# EasyEDA Pro project 赛博樱花灯.epro, schematic Schematic2
Board Name: 下主板V0.1; Create Date: 2025-05-02; Page Name: P1; Project Name: 噬菌体拾音灯; Schematic Name: Schematic2; Update Date: 2025-05-07; Company: 嘉立创EDA; Page Size: A3; Version: V1.0
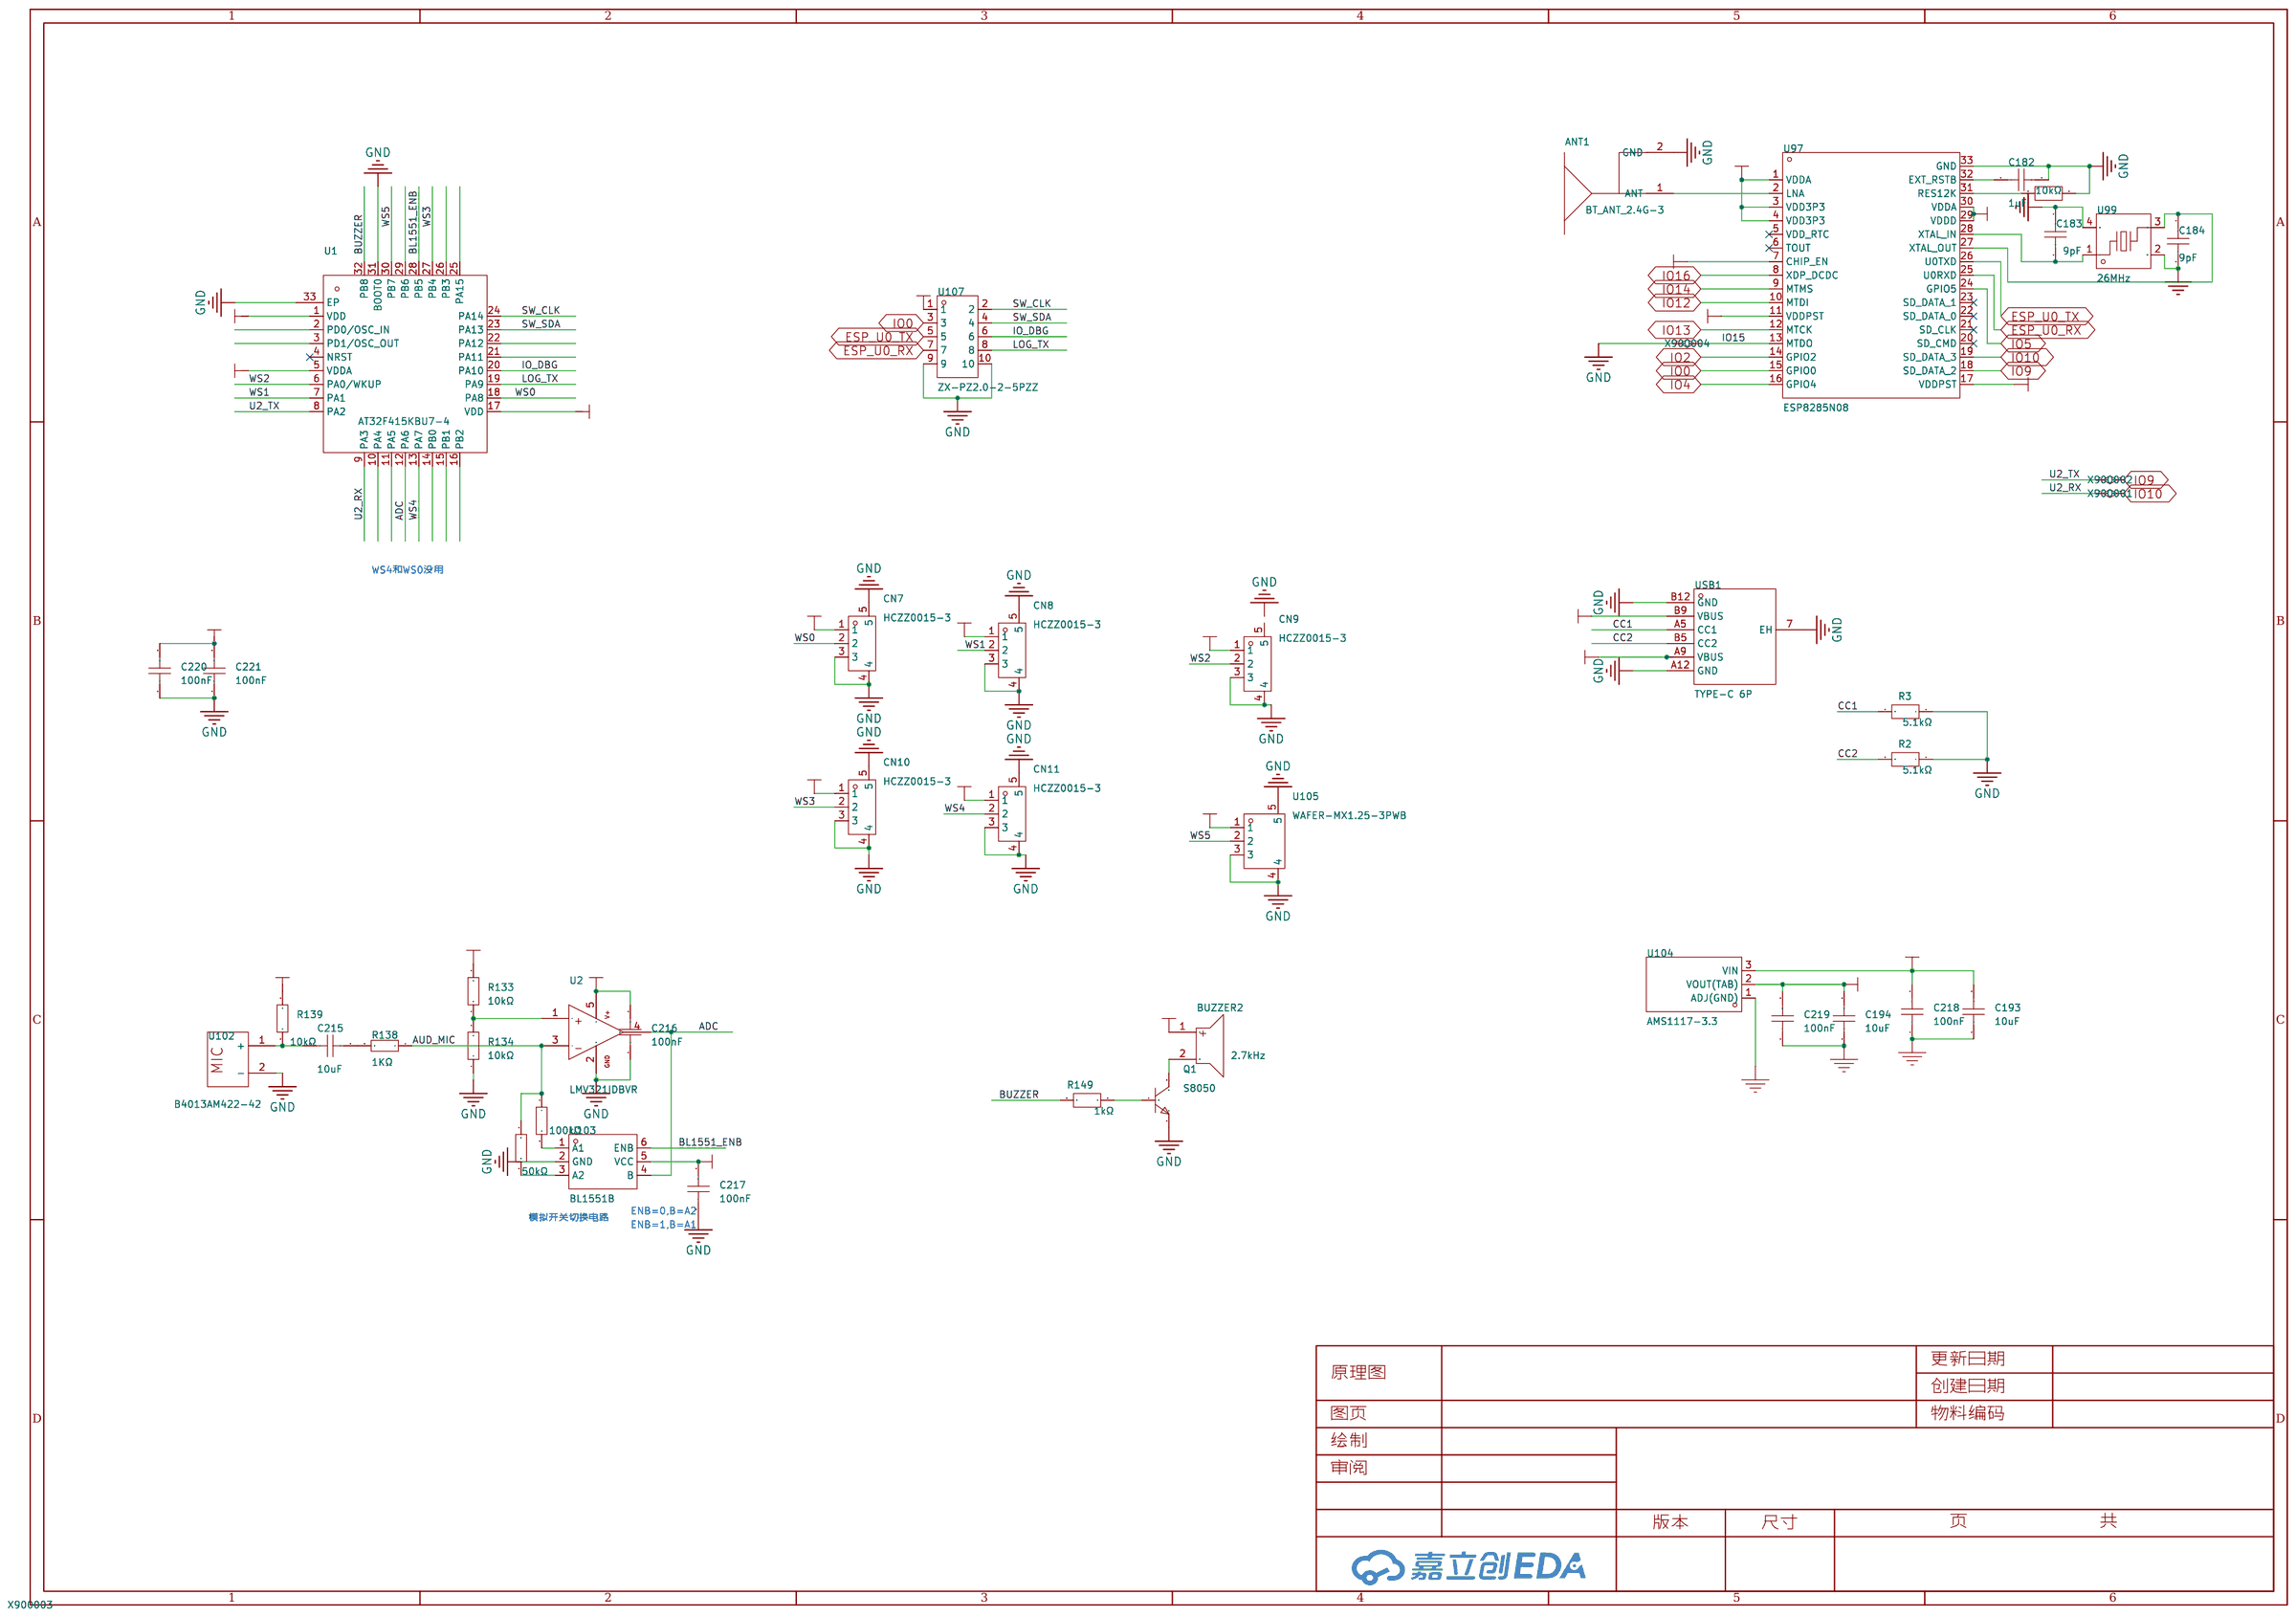
[diagram p2: schematic sheet]

## Parts
ANT1  BT_ANT_2.4G-3  [ANT-2.4G-3]
BUZZER2  2.7kHz  [BUZ-TH_BD9.0-P4.00-D0.6-FD]
C182  1uF  [C0603]
C183  9pF  [C0603]
C184  9pF  [C0603]
C193  10uF  [C0603]
C194  10uF  [C0603]
C215  10uF  [C0402]
C216  100nF  [C0603]
C217  100nF  [C0603]
C218  100nF  [C0603]
C219  100nF  [C0603]
C220  100nF  [C0603]
C221  100nF  [C0603]
CN7  HCZZ0015-3  [CONN-SMD_3P-P1.25-L3.3-W8.8]
CN8  HCZZ0015-3  [CONN-SMD_3P-P1.25-L3.3-W8.8]
CN9  HCZZ0015-3  [CONN-SMD_3P-P1.25-L3.3-W8.8]
CN10  HCZZ0015-3  [CONN-SMD_3P-P1.25-L3.3-W8.8]
CN11  HCZZ0015-3  [CONN-SMD_3P-P1.25-L3.3-W8.8]
Q1  S8050  [SOT-23-3_L2.9-W1.3-P1.90-LS2.3-BR]
R2  5.1kΩ  [R0603]
R3  5.1kΩ  [R0603]
R133  10kΩ  [R0402]
R134  10kΩ  [R0402]
R138  1KΩ  [R0402]
R139  10kΩ  [R0402]
R146  10kΩ  [R0603]
R147  100kΩ  [R0402]
R148  50kΩ  [R0402]
R149  1kΩ  [R0603]
U1  AT32F415KBU7-4  [QFN-32_L4.0-W4.0-P0.40-BL-EP2.7]
U2  LMV321IDBVR  [SOT-23-5_L3.0-W1.7-P0.95-LS2.8-BR]
U97  ESP8285N08  [QFN-32_L5.0-W5.0-P0.50-TL-EP3.7]
U99  26MHz  [CRYSTAL-SMD_4P-L3.2-W2.5-BL]
U102  B4013AM422-42  [MIC-SMD_3P-BD4.0-P1.35_B4013AM423-093]
U103  BL1551B  [SC-70-6_L2.1-W1.3-P0.65-LS2.3-BR]
U104  AMS1117-3.3  [SOT-89_L4.5-W2.5-P1.50-LS4.2-BR]
U105  WAFER-MX1.25-3PWB  [CONN-SMD_3P-P1.25_WAFER-MX1.25-3PWB]
U107  ZX-PZ2.0-2-5PZZ  [HDR-TH_10P-P2.00-V-M-R2-C5-S2.00]
USB1  TYPE-C 6P  [TYPE-C-SMD_TYPE-C-6P]

## Library data of the parts
ANT1 = BT_ANT_2.4G-3
BUZZER2 = QMB-09B-03: 驱动方式:无源(外部驱动);构造类型:电磁式;频率:2.7kHz;声压(SPL):85dB;; LCSC Part Name: 无源蜂鸣器QMB-09B-03; Supplier Part: C96256; Manufacturer: 华能; Supplier Footprint: 插件,D=9mm; JLCPCB Part Class: 扩展库; Datasheet: https://atta.szlcsc.com/upload/public/pdf/source/20210401/C96256_958B17753B5AD7CBFBCFFC7C095B4484.pdf; Supplier: LCSC; Driver Circuitry: 无源(外部驱动); Technology: 电磁式; Voltage - Supply: 2V~5V; Sound Pressure Level(SPL): 85dB; Diameter(φD): 9mm; Height: 5.7mm
C182-C184 = CAP_0603: 容值:100nF;精度:±10%;额定电压:50V;温度系数:X7R;; Supplier Footprint: 0603
C193 C194 = CL10A106MA8NRNC: 容值:10uF;精度:±20%;额定电压:25V;材质(温度系数):X5R;; LCSC Part Name: 10uF ±20% 25V; Supplier Part: C96446; Manufacturer: SAMSUNG(三星); Supplier Footprint: 0603; JLCPCB Part Class: 基础库; Datasheet: https://atta.szlcsc.com/upload/public/pdf/source/20160218/1457707763339.pdf; Supplier: LCSC; Tolerance: ±20%; Voltage Rated: 25V; Temperature Coefficient: X5R
C215 = CL05A105KA5NQNC: 容值:1uF;精度:±10%;额定电压:25V;材质(温度系数):X5R;; LCSC Part Name: 1uF ±10% 25V; Supplier Part: C52923; Manufacturer: SAMSUNG(三星); Supplier Footprint: 0402; JLCPCB Part Class: 基础库; Datasheet: https://atta.szlcsc.com/upload/public/pdf/source/20160218/1457707763339.pdf; Supplier: LCSC; Tolerance: ±10%; Voltage Rated: 25V; Temperature Coefficient: X5R
C216-C221 = CGA0603X7R104K500JT: 容值:100nF;精度:±10%;额定电压:50V;温度系数:X7R;; LCSC Part Name: 100nF ±10% 50V; Supplier Part: C6119867; Manufacturer: HRE(芯声); Supplier Footprint: 0603; JLCPCB Part Class: 扩展库; Datasheet: https://atta.szlcsc.com/upload/public/pdf/source/20250103/C44077DA9E7B3EFAE02F22B6D3D1CBC9.pdf; Supplier: LCSC; Tolerance: ±10%; Voltage Rating: 50V; Temperature Coefficient: X7R
CN7-CN11 = HCZZ0015-3: 插针结构:1x3P;间距:1.25mm;安装方式:立贴;参考系列:PicoBlade(MX 1.25);总PIN数:3P;排数:1;每排PIN数:3;行距:-;额定电流:1A;触头材质:铜;触头镀层:锡;工作温度:-25℃~+70℃;; LCSC Part Name: 米色 1x3P 间距:1.25mm 立贴闭口不加盖 系列:PicoBlade(MX 1.25); Supplier Part: C7433469; Manufacturer: HC(虹成电子); Supplier Footprint: SMD,P=1.25mm; JLCPCB Part Class: 扩展库; Datasheet: https://atta.szlcsc.com/upload/public/pdf/source/20250106/1F447D40D9750342B547DDF7C651415A.pdf; Supplier: LCSC; Pins Structure: 1x3P; Pitch: 1.25mm; Mounting Type: 立贴; Reference Series: PicoBlade(MX 1.25); Number of Pins: 3P; Number of Rows: 1; Number of PINs Per Row: 3; Current Rating: 1A; Contact Material: 铜; Contact Plating: 锡; Operating Temperature: -25℃~+70℃; Voltage Rating: 125V; Plastic Material: LCP; Color: 米色; Z-Height of the Board: 4.6mm; X-Length of Bottom Edge on Board (Spacing Line): 8.85mm; Y-Width of Bottom Edge on Board: 4.3mm
Q1 = S8050_C20069125: 晶体管类型:NPN;集电极电流(Ic):500mA;集射极击穿电压(Vceo):25V;耗散功率(Pd):300mW;直流电流增益(hFE):120@50mA,1.0V;; LCSC Part Name: hFE:200-350，丝印:J3Y S8050; Supplier Part: C20069125; Manufacturer: 宏嘉诚; Supplier Footprint: SOT-23; JLCPCB Part Class: 扩展库; Datasheet: https://atta.szlcsc.com/upload/public/pdf/source/20250107/343E8B94B5C24D0D65D7D4B70E0B73F6.pdf; Supplier: LCSC; type: NPN; Current - Collector(Ic): 500mA; Collector - Emitter Voltage VCEO: 25V; Pd - Power Dissipation: 300mW; DC Current Gain: 120@50mA,1.0V; Transition frequency(fT): 100MHz; Current - Collector Cutoff: 100nA; Vce Saturation(VCE(sat)): 600mV; Operating Temperature: -55℃~+150℃
R2 R3 R146 R149 = td03g5101bt: 温度系数:±25ppm/℃;精度:±0.1%;功率:100mW;阻值:5.1kΩ;最大工作电压:50V;工作温度范围:-55℃~+155℃;; LCSC Part Name: 5.1KΩ(5101) ±0.1% 1/10W; Supplier Part: C667001; Manufacturer: FH(风华); Manufacturer Part: TD03G5101BT; Supplier Footprint: 0603; JLCPCB Part Class: Extended Part; Datasheet: https://atta.szlcsc.com/upload/public/pdf/source/20200616/C657321_2CFA27FA726BC0D0F6223AF922169515.pdf; Supplier: LCSC; Temperature Coefficient: ±25ppm/℃; Tolerance: ±0.1%; Power(Watts): 100mW; Overload Voltage (Max): 50V; Operating Temperature Range: -55℃~+155℃
R133 R134 R139 R147 R148 = 0402WGF1002TCE: 电阻类型:厚膜电阻;阻值:10kΩ;精度:±1%;功率:62.5mW;最大工作电压:50V;温度系数:±100ppm/℃;; LCSC Part Name: 10kΩ ±1% 62.5mW 厚膜电阻; Supplier Part: C25744; Manufacturer: UNI-ROYAL(厚声); Supplier Footprint: 0402; JLCPCB Part Class: 基础库; Datasheet: https://atta.szlcsc.com/upload/public/pdf/source/20200306/C422600_1E6D84923E4A46A82E41ADD87F860B5C.pdf; Supplier: LCSC; Type: 厚膜电阻; Tolerance: ±1%; Power(Watts): 62.5mW; Overload Voltage (Max): 50V; Temperature Coefficient: ±100ppm/℃; Operating Temperature Range: -55℃~+155℃
R138 = 0402WGF1001TCE: 电阻类型:厚膜电阻;阻值:1kΩ;精度:±1%;功率:62.5mW;最大工作电压:50V;温度系数:±100ppm/℃;; LCSC Part Name: 1kΩ ±1% 62.5mW 厚膜电阻; Supplier Part: C11702; Manufacturer: UNI-ROYAL(厚声); Supplier Footprint: 0402; JLCPCB Part Class: Basic Part; Datasheet: https://atta.szlcsc.com/upload/public/pdf/source/20200306/C422600_1E6D84923E4A46A82E41ADD87F860B5C.pdf; Supplier: LCSC; Type: 厚膜电阻; Tolerance: ±1%; Power(Watts): 62.5mW; Overload Voltage (Max): 50V; Temperature Coefficient: ±100ppm/℃; Operating Temperature Range: -55℃~+155℃
U1 = AT32F415KBU7-4: 频率 (MHz)：150，FLASH (KB)：128，SRAM (KB)：32，CPU：ARM? Cortex?-M4，工作电压（V）：2.6~3.6，工作温度：-40°C ~ 105°C，封装：QFN32; Supplier Part: C528424; Manufacturer: ARTERY(雅特力); Supplier Footprint: QFN-32-EP(4x4); JLCPCB Part Class: 扩展库; Datasheet: https://atta.szlcsc.com/upload/public/pdf/source/20200507/C528425_955931935851DA1D79A558202FE2F03A.pdf; Supplier: LCSC
U2 = LMV321IDBVR_C7972: 放大器数:单路;轨到轨:-;增益带宽积(GBP):1MHz;压摆率(SR):1V/us;输入偏置电流(Ib):15nA;; LCSC Part Name: 低电压轨到轨输出运算放大器; Supplier Part: C7972; Manufacturer: TI(德州仪器); Supplier Footprint: SOT-23-5; JLCPCB Part Class: 扩展库; Datasheet: https://www.ti.com/cn/lit/gpn/lmv321; Supplier: LCSC; Number of Circuits: 单路; Gain Bandwidth Product(GBP): 1MHz; Slew Rate(SR): 1V/us; Current - Input Bias(Ib): 15nA; Quiescent Current: 130uA; Output Current: 160mA; Operating Temperature: -40℃~+125℃
U97 = ESP8285N08: 频率范围:2.4GHz~2.483GHz;接口:ADC,GPIO,I2C,I2S,PWM,SDIO,SPI,UART;应用领域:WiFi;数据速率:72.2Mbps;灵敏度:-97dBm;典型应用频率:-;; Supplier Part: C967018; Manufacturer: ESPRESSIF(乐鑫); Supplier Footprint: QFN-32-EP(5x5); JLCPCB Part Class: Extended Part; Datasheet: https://atta.szlcsc.com/upload/public/pdf/source/20201208/C967018_16BE38E2B139B5CC4A4A2601BD6D347C.pdf; Supplier: LCSC; Frequency Range: 2.4GHz~2.483GHz; Interface: ADC,GPIO,I2C,I2S,PWM,SDIO,SPI,UART; Operating Voltage: 2.7V~3.6V; Applications: WiFi; Output Power: 20dBm; Data Rate: 72.2Mbps; Current Of Transmitting: 142mA; Sensitivity: -97dBm; Receive Current: 72mA; Operating Temperature: -40℃~+85℃
U99 = CF4040M00012: 晶振类型:贴片晶振;频率:40MHz;常温频差:±10ppm;外接负载电容:12pF;频率稳定度(全温):±20ppm;; LCSC Part Name: 40MHz ±10ppm 12pF; Supplier Part: C5765977; Manufacturer: JWT(晶威特); Supplier Footprint: 3225; JLCPCB Part Class: Extended Part; Supplier: LCSC; Crystal Type: 贴片晶振; Normal temperature Frequency Tolerance: ±10ppm; External load capacitor: 12pF; Frequency Stability(Full temperature range): ±20ppm
U102 = B4013AM422-42: LCSC Part Name: 驻极体电容φ4.0*1.3mm 1.0V-10V 灵敏度-42dB; Supplier Part: C233793; Manufacturer: Goertek(歌尔); JLCPCB Part Class: 扩展库; Datasheet: https://atta.szlcsc.com/upload/public/pdf/source/20180814/C233793_43E8861140E7BA7E04B570EE6088229F.pdf; Supplier: LCSC
U103 = BL1551B: LCSC Part Name: 2.7Ω低压SPDT模拟开关; Supplier Part: C2944066; Manufacturer: BL(上海贝岭); Supplier Footprint: SC-70-6; JLCPCB Part Class: 扩展库; Datasheet: https://atta.szlcsc.com/upload/public/pdf/source/20220111/7C5AAA5FC97DA844C85990CC55D99B47.pdf; Supplier: LCSC
U104 = AMS1117-3.3_C347256: 输出类型:固定;输出极性:正;输出通道数:1;最大输入电压:18V;输出电压:3.3V;压差:1.3V@(1A);输出电流:1A;电源纹波抑制比(PSRR):60dB@(120Hz);; LCSC Part Name: 正 Vin=18V Vout=3.3V 1A 60dB@(120Hz); Supplier Part: C347256; Manufacturer: UMW(广东友台半导体); Supplier Footprint: SOT-89; JLCPCB Part Class: Extended Part; Datasheet: https://atta.szlcsc.com/upload/public/pdf/source/20211011/50CC665C22E3A66C08379A4A74BDA25C.pdf; Supplier: LCSC; Output Type: 固定; Output Polarity: 正; Number of Outputs: 1; Maximum Input Voltage: 18V; Output Voltage: 3.3V; Dropout Voltage: 1.3V@(1A); Output Current: 1A; Power Supply Rejection Ratio (PSRR): 60dB@(120Hz)
U105 = WAFER-MX1.25-3PWB: 插针结构:1x3P;间距:1.25mm;安装方式:卧贴;参考系列:PicoBlade(MX 1.25);总PIN数:3P;排数:1;每排PIN数:3;行距:-;额定电流:1A;触头材质:黄铜;触头镀层:-;工作温度:-25℃~+85℃;; LCSC Part Name: 1x3P 间距:1.25mm 卧贴 系列:PicoBlade(MX 1.25); Supplier Part: C3029360; Manufacturer: XUNPU(讯普); Supplier Footprint: SMD,P=1.25mm,卧贴; JLCPCB Part Class: 扩展库; Datasheet: https://atta.szlcsc.com/upload/public/pdf/source/20220527/5ACBB683E384B6AD06743F272F933620.pdf; Supplier: LCSC; Pins Structure: 1x3P; Pitch: 1.25mm; Mounting Type: 卧贴; Reference Series: PicoBlade(MX 1.25); Number of Pins: 3P; Number of Rows: 1; Number of PINs Per Row: 3; Current Rating: 1A; Contact Material: 黄铜; Operating Temperature: -25℃~+85℃; Voltage Rating: 125V; Plastic Material: LCP; Supplementary Features: 辅助焊脚; Color: 米色; Z-Height of the Board: 3.6mm; X-Length of Bottom Edge on Board (Spacing Line): 8.75mm; Y-Width of Bottom Edge on Board: 5.25mm
U107 = ZX-PZ2.0-2-5PZZ: 插针结构:2x5P;间距:2mm;行距:2mm;圆针/方针:方针;安装类型:直插;排数:双排;总PIN位数:10P;额定电流:1.5A;额定电压:500V;配合针长度:3.9mm;塑高:2mm;端接针长度:2.8mm;触头材质:黄铜;触头镀层:金;工作温度范围:-40℃~+105℃;焊接温度(最大值):-;颜色:黑色;; LCSC Part Name: 2x5P 间距:2mm 方针 直插; Supplier Part: C7501288; Manufacturer: Megastar(兆星); Supplier Footprint: 插件,P=2mm; JLCPCB Part Class: 扩展库; Datasheet: https://atta.szlcsc.com/upload/public/pdf/source/20231122/5A068C763F75A697CB422213713AF888.pdf; Supplier: LCSC; Pin Structure: 2x5P; Pitch: 2mm; Row Spacing: 2mm; Circluar Pins/Square Pins: 方针; Mounting Type: 直插; Number of Rows: 双排; Number of Pins: 10P; Current Rating (Max): 1.5A; Voltage Rating (Max): 500V; Length of Mating Pin: 3.9mm; Insulation Height: 2mm; Length of End Connection Pin: 2.8mm; Contact Material: 黄铜; Contact Plating: 金; Operating Temperature Range: -40℃~+105℃; Color: 黑色
USB1 = TYPE-C 6P: 连接器类型:Type-C;标准:USB 3.1;公母:母;安装方式:卧贴;触点数量:6P;端口数量:1;额定电流 - 电源:5A;工作温度范围:-40℃~+85℃;; LCSC Part Name: Type-C 母 卧贴; Supplier Part: C456012; Manufacturer: SHOU HAN(首韩); Supplier Footprint: SMD; JLCPCB Part Class: 扩展库; Datasheet: https://atta.szlcsc.com/upload/public/pdf/source/20201203/C456012_B13F72044DF846EDBE9BDD0D1D3CD166.pdf; Supplier: LCSC; Connector Type: Type-C; Standard: USB 3.1; Gender: 母; Mounting Style: 卧贴; Number of Contacts: 6P; Number of Ports: 1; Current Rating - Power (Max): 5A; Operating Temperature Range: -40℃~+85℃; Rated Voltage (Max): 20V; Connect-Disconnect Life: 3千次; Core Colour: 黑色

## Nets
3V3: C194.2 C216.2 C217.2 C219.2 C220.2 C221.2 R133.2 R139.2 U1.1(VDD) U1.5(VDDA) U1.17(VDD) U2.5(V+) U97.1(VDDA) U97.3(VDD3P3) U97.4(VDD3P3) U97.7(CHIP_EN) U97.11(VDDPST) U97.17(VDDPST) U97.29(VDDD) U97.30(VDDA) U103.5(VCC) U104.2(VOUT(TAB))
GND: ANT1.2(GND) C182.1 C183.1 C184.2 C193.1 C194.1 C216.1 C217.1 C218.1 C219.1 C220.1 C221.1 CN7.3 CN7.4 CN7.5 CN8.3 CN8.4 CN8.5 CN9.3 CN9.4 CN10.3 CN10.4 CN10.5 CN11.3 CN11.4 CN11.5 Q1.2(E) R2.1 R3.1 R134.1 R146.1 U1.31(BOOT0) U1.33(EP) U2.2(GND) U97.13(MTDO) U97.33(GND) U99.2(GND) U99.4(GND) U102.2(-) U103.2(GND) U104.1(ADJ(GND)) U105.3 U105.4 U105.5 U107.9 U107.10 USB1.7(EH) USB1.A12(GND) USB1.B12(GND)
V5: BUZZER2.1 C193.2 C218.2 CN7.1 CN8.1 CN9.1 CN10.1 CN11.1 U104.3(VIN) U105.1 U107.1 USB1.A9(VBUS) USB1.B9(VBUS)
ADC: U1.12(PA6) U2.4(OUT) U103.4(B)
AUD_MIC: R138.1 R147.1 R148.1 U2.3(-)
BL1551_ENB: U1.28(PB5) U103.6(ENB)
BUZZER: R149.2 U1.32(PB8)
CC1: R3.2 USB1.A5(CC1)
CC2: R2.2 USB1.B5(CC2)
ESP_U0_RX: U97.25(U0RXD) U107.7
ESP_U0_TX: U97.26(U0TXD) U107.5
IO0: U97.15(GPIO0) U107.3
IO2: U97.14(GPIO2)
IO4: U97.16(GPIO4)
IO5: U97.24(GPIO5)
IO9: U1.8(PA2) U97.18(SD_DATA_2)
IO10: U1.9(PA3) U97.19(SD_DATA_3)
IO12: U97.10(MTDI)
IO13: U97.12(MTCK)
IO14: U97.9(MTMS)
IO16: U97.8(XDP_DCDC)
IO_DBG: U1.20(PA10) U107.6
LOG_TX: U1.19(PA9) U107.8
SW_CLK: U1.24(PA14) U107.2
SW_SDA: U1.23(PA13) U107.4
WS0: CN7.2 U1.18(PA8)
WS1: CN8.2 U1.7(PA1)
WS2: CN9.2 U1.6(PA0/WKUP)
WS3: CN10.2 U1.27(PB4)
WS4: CN11.2 U1.13(PA7)
WS5: U1.30(PB7) U105.2
$1N1069: ANT1.1(ANT) U97.2(LNA)
$1N1076: C184.1 U97.27(XTAL_OUT) U99.3
$1N1080: C182.2 U97.32(EXT_RSTB)
$1N1081: C183.2 U97.28(XTAL_IN) U99.1
$1N1083: R146.2 U97.31(RES12K)
$1N1545: C215.1 R139.1 U102.1(+)
$1N1546: C215.2 R138.2
$1N2130: R133.1 R134.2 U2.1(+)
$1N2304: R147.2 U103.1(A1)
$1N2327: R148.2 U103.3(A2)
$1N9735: Q1.1(B) R149.1
$1N9739: BUZZER2.2 Q1.3(C)

Not connected (* = marked no-connect by the designer): CN9 5; U1 2(PD0/OSC_IN) 3(PD1/OSC_OUT) 4(NRST)* 10(PA4) 11(PA5) 14(PB0) 15(PB1) 16(PB2) 21(PA11) 22(PA12) 25(PA15) 26(PB3) 29(PB6); U97 5(VDD_RTC)* 6(TOUT)* 20(SD_CMD)* 21(SD_CLK)* 22(SD_DATA_0)* 23(SD_DATA_1)*

## Notes on the sheet
- WS4和WS0没用
- 模拟开关切换电路
- ENB=0,B=A2
- ENB=1,B=A1
